# Altium schematic sheet CAL JIG.SchDoc: ELECTRODE CALIBRATION JIG
size A4; DrawnBy: Lucas Church; Revision: A; SheetNumber: 1; SheetTotal: 1
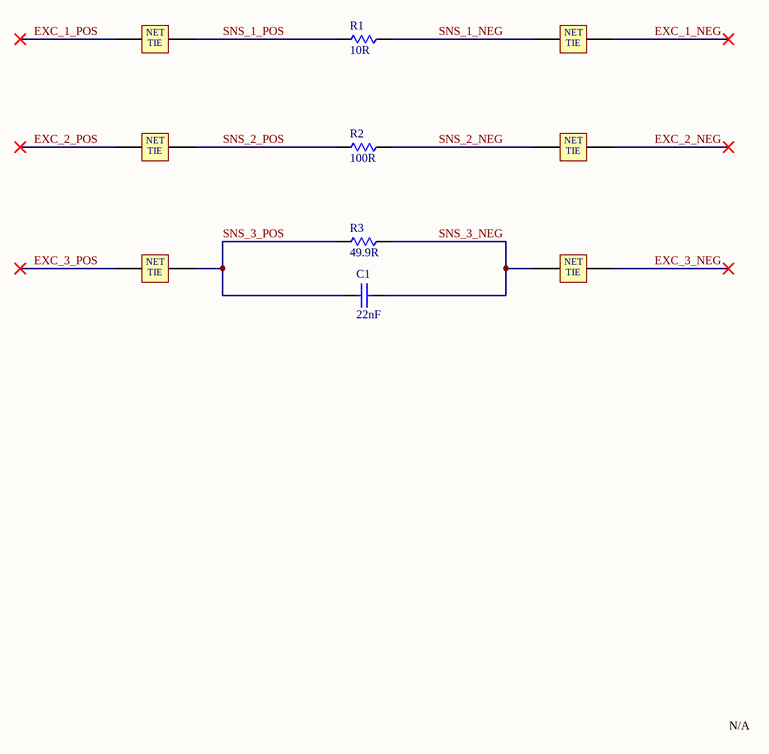
[diagram p0: CAL JIG.SchDoc]

## Parts
C1  22nF  [0603-CAP]
NT1  Net Tie  [Net Tie 10mil]  (value not drawn)  (net tie, no BOM)
NT2  Net Tie  [Net Tie 10mil]  (value not drawn)  (net tie, no BOM)
NT3  Net Tie  [Net Tie 10mil]  (value not drawn)  (net tie, no BOM)
NT4  Net Tie  [Net Tie 10mil]  (value not drawn)  (net tie, no BOM)
NT5  Net Tie  [Net Tie 10mil]  (value not drawn)  (net tie, no BOM)
NT6  Net Tie  [Net Tie 10mil]  (value not drawn)  (net tie, no BOM)
R1  10R  [0603-RES]
R2  100R  [0603-RES]
R3  49.9R  [0603-RES]

## Nets
EXC_1_NEG: NT2.2
EXC_1_POS: NT1.1
EXC_2_NEG: NT4.2
EXC_2_POS: NT3.1
EXC_3_NEG: NT6.2
EXC_3_POS: NT5.1
SNS_1_NEG: NT2.1 R1.2
SNS_1_POS: NT1.2 R1.1
SNS_2_NEG: NT4.1 R2.2
SNS_2_POS: NT3.2 R2.1
SNS_3_NEG: C1.2 NT6.1 R3.2
SNS_3_POS: C1.1 NT5.2 R3.1

## Notes on the sheet
- N/A
- (in symbol Net Tie) NET; TIE

## Library data of the parts
C1 = CC0603JRNPO9BN471: CAP CER 470PF 50V NPO 0603; Manufacturer 1: Yageo; Tech#: SMT; Manufacturer Part Number 1: CC0603JRNPO9BN471; Detailed Description: CAP CER 470PF 50V NPO 0603; Supplier 1: DigiKey; Supplier Part Number 1: 311-1520-1-ND; Supplier 2: Mouser; Supplier Part Number 2: 603-C0603JRNPO9BN471; Price(100): 0.0224; Price(250): 0.01824
NT1-NT6 = Net Tie: Tying two nets; Detailed Description: Tying two nets
R1-R3 = 1K 0603: RES SMD 1K OHM 1% 1/10W 0603; Manufacturer Part Number 1: ERJ-3EKF1001V; Manufacturer 1: Panasonic; Tech#: SMT; Detailed Description: RES SMD 1K OHM 1% 1/10W 0603; Supplier 1: DigiKey; Supplier Part Number 1: P1.00KHCT-ND; Supplier 2: Mouser; Supplier Part Number 2: 667-ERJ-3EKF1001V; Price(100): 0.0129